# Altium schematic sheet BLE-HM10.SchDoc
size A4
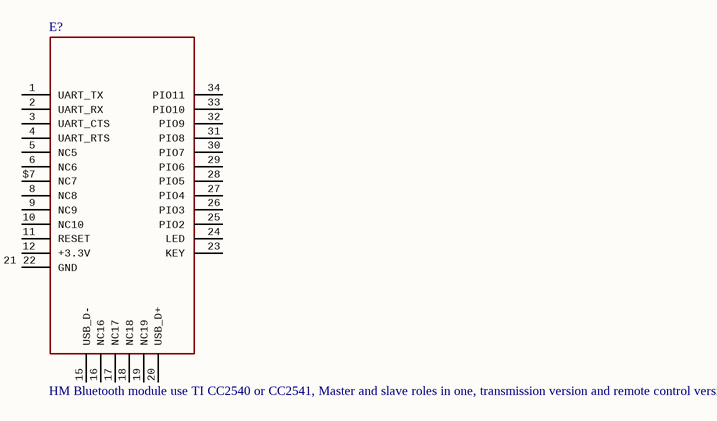
[diagram p0: BLE-HM10.SchDoc]

## Parts
E?  HM Bluetooth module use TI CC2540 or CC2541, Master and slave roles in one, transmission version and remote control version and PIO state acquisition functions in one, Support the AT command modify module parameters, Convenient and flexible.  [26.9X13X2.2_BOARD]

## Nets

Not connected (* = marked no-connect by the designer): E? 1(UART_TX) 2(UART_RX) 3(UART_CTS) 4(UART_RTS) 5(NC5) 6(NC6) 8(NC8) 9(NC9) 10(NC10) 11(RESET) 12(+3.3V) 13 14 21 22(GND) 15(USB_D-) 16(NC16) 17(NC17) 18(NC18) 19(NC19) 20(USB_D+) 23(KEY) 24(LED) 25(PIO2) 26(PIO3) 27(PIO4) 28(PIO5) 29(PIO6) 30(PIO7) 31(PIO8) 32(PIO9) 33(PIO10) 34(PIO11) $7(NC7)

## Library data of the parts
E? = HM-10-BOARD